# Altium schematic sheet nRF52840.SchDoc
size A4; Organization: Memristor-Robotics; Address1: Vladimira Perića Valtera; Address2: Novi Sad, 21000; Address3: Serbia; SheetNumber: 2; SheetTotal: 5
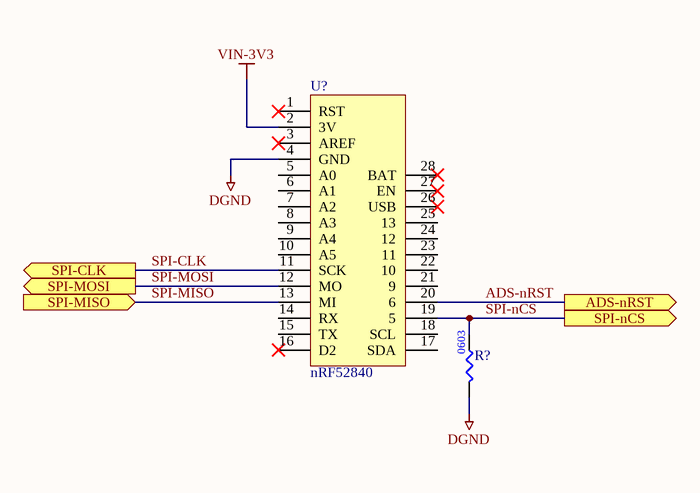
[diagram p0: nRF52840.SchDoc]

## Parts
R?  RES_0603  [RES0603]  (value not drawn)
U?  nRF52840  [nRF52840]

## Ports
ADS-nRST (out), SPI-CLK (out), SPI-MISO (in), SPI-MOSI (out), SPI-nCS (out)

## Nets
DGND: R?.1 U?.4(GND)
VIN-3V3: U?.2(3V)
ADS-nRST: U?.20(6) ; port ADS-nRST
SPI-CLK: U?.11(SCK) ; port SPI-CLK
SPI-MISO: U?.13(MI) ; port SPI-MISO
SPI-MOSI: U?.12(MO) ; port SPI-MOSI
SPI-nCS: R?.2 U?.19(5) ; port SPI-nCS

Not connected (* = marked no-connect by the designer): U? 1(RST)* 3(AREF)* 5(A0) 6(A1) 7(A2) 8(A3) 9(A4) 10(A5) 14(RX) 15(TX) 16(D2)* 17(SDA) 18(SCL) 21(9) 22(10) 23(11) 24(12) 25(13) 26(USB)* 27(EN)* 28(BAT)*

## Notes on the sheet
- Title
- Date:
- Design Engineer:
- Time:
- Revision:
- Sheet
- of
- Size:
- A4
- www.memristor-robotics.io
- File:
- (in symbol RES_0603) 0603

## Library data of the parts
R? = RES_0603: Generic 0603 resistor
U? = nRF52840: FEATHER NRF52840 SENSE; Manufacturer Part Number: nRF52840; Supplier 1: Mouser; Supplier Part Number 1: 485-4516; Supplier 2: Digi-Key; Supplier Part Number 2: 1528-4516-ND; ComponentLink1Description: Datasheet; ComponentLink1URL: https://cdn-learn.adafruit.com/downloads/pdf/adafruit-feather-sense.pdf